# EAGLE board main_V3.0 (EAGLE 7.2.0)
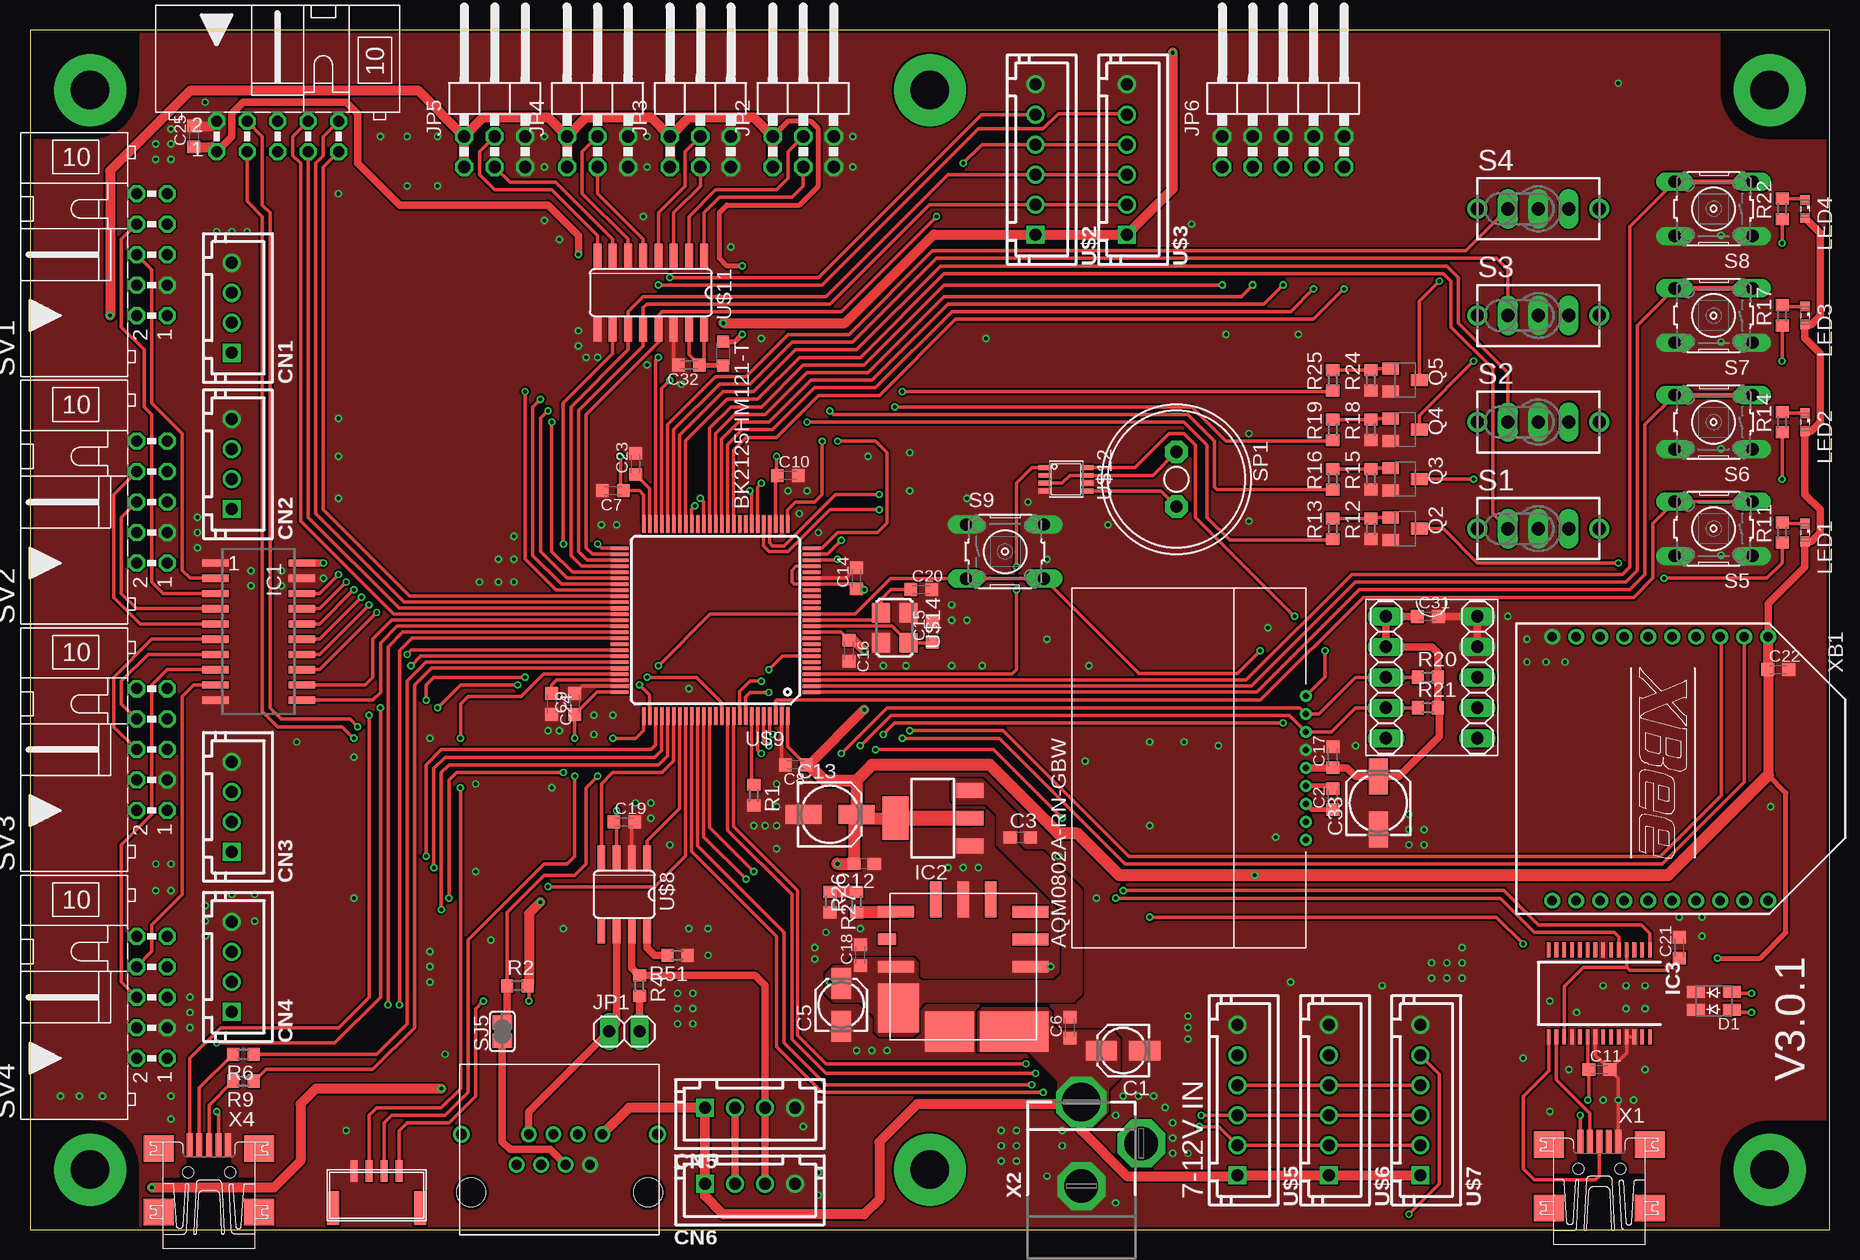
[diagram p3: board, top side]
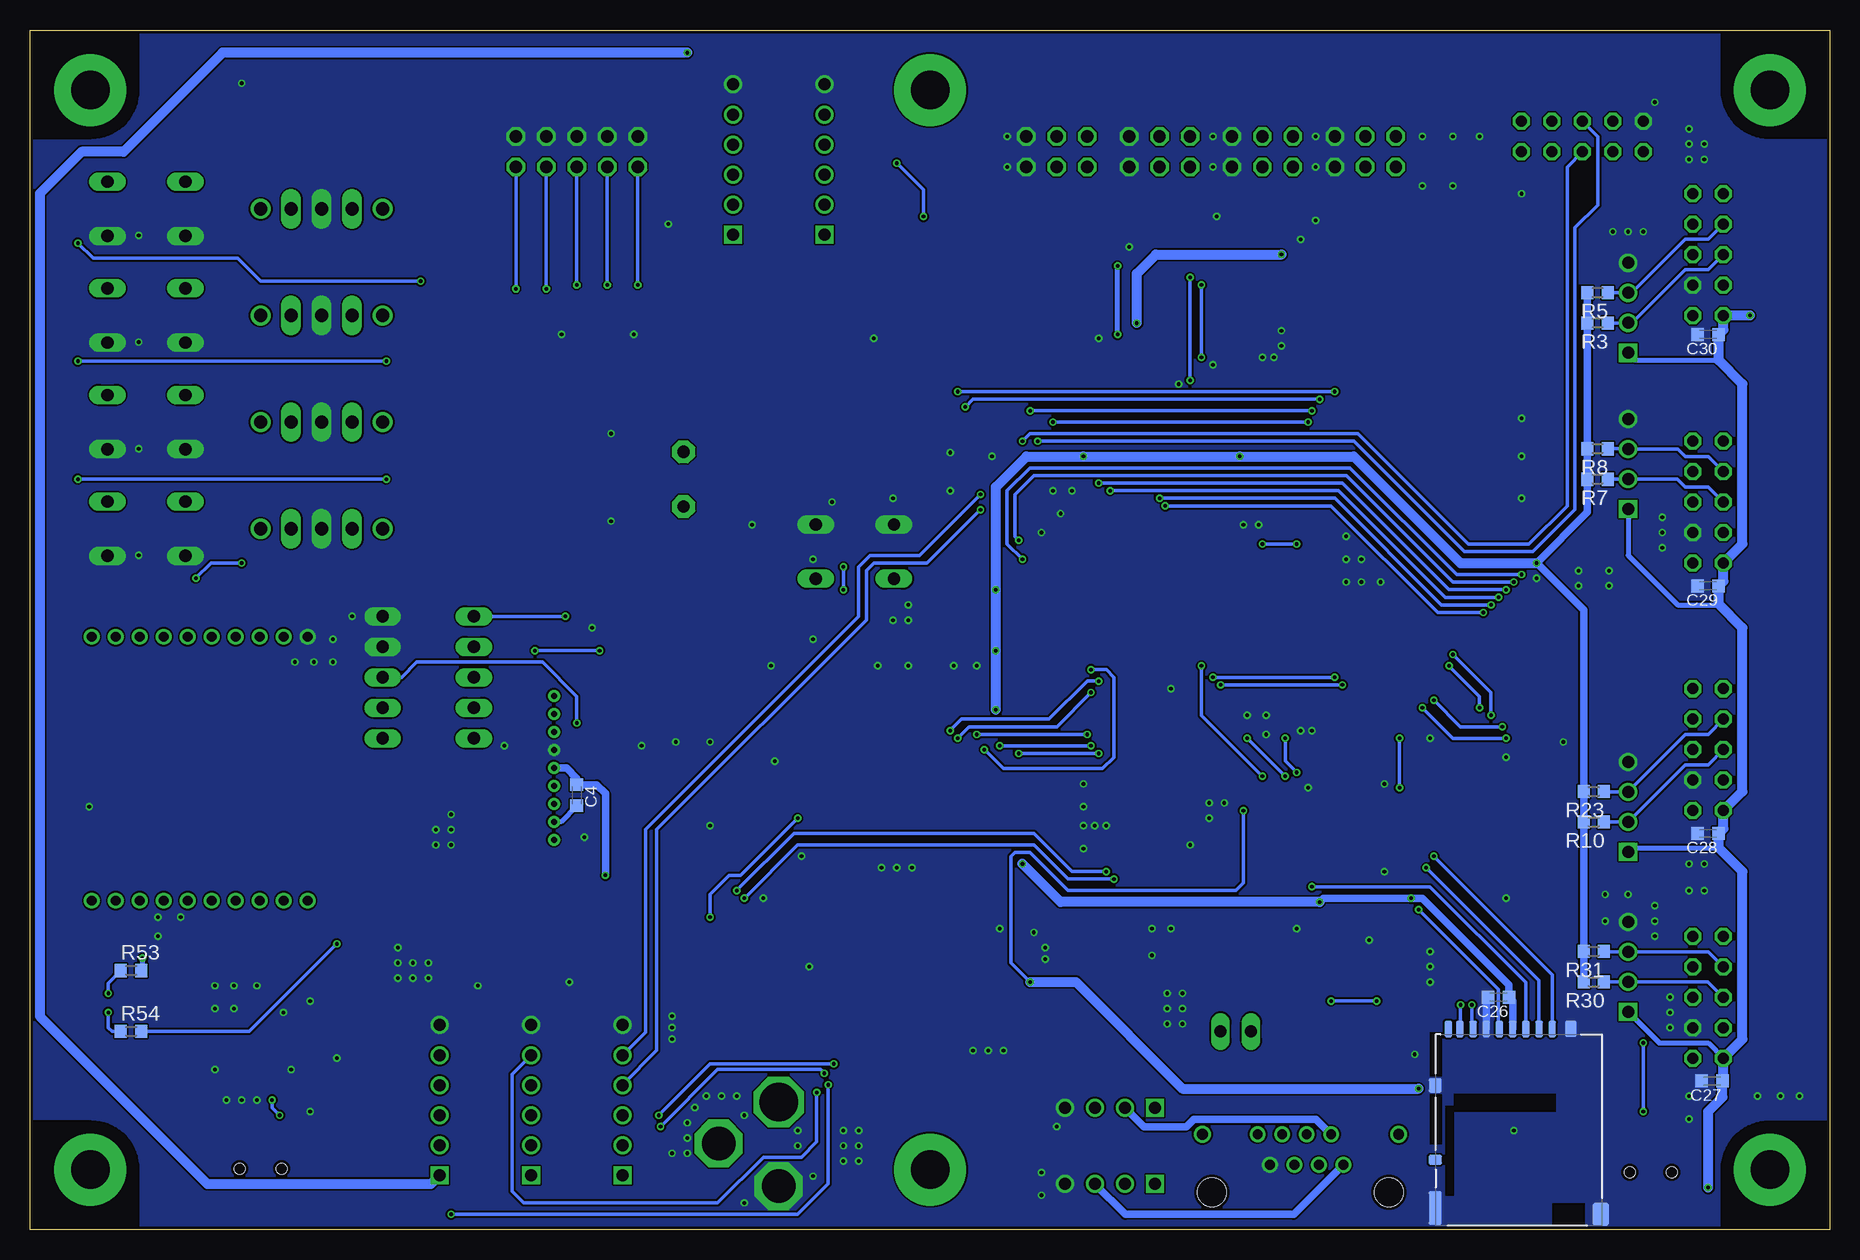
[diagram p4: board, bottom side, seen from below]

Size 150 x 100 mm. Coordinates in mm from the lower left corner, seen from the top.
Outline: 0,0 150,0 150,100 0,100 0,0
Copper layers (1*16): Top 0.035mm / dielectric 1.5mm / Bottom 0.035mm
Design rules "Elecrow_2-layer_eagle_rule": minimum track width 6mil, minimum drill 12mil, track to track 6mil, track to pad 6mil, pad to pad 6mil, via to via 6mil, smd to smd 0mil, copper to edge 10mil, drill to drill 10mil, minimum pad ring 10mil, minimum via ring 6mil, stop-mask expansion 2mil, vias tented up to drill 100mil, thermal gap 10mil
tRestrict: 12 lines
bRestrict: 12 lines

## Footprints (pad centres in the part's own frame; a part is rotated, then mirrored left to right if it is on the bottom)
AQM0802 = drill 0.5: P$1 9,0; P$2 10.5,0; P$3 12,0; P$4 13.5,0; P$5 15,0; P$6 16.5,0; P$7 18,0; P$8 19.5,0; P$9 21,0
L2012C = smd 1 x 1: 1 -1,0; 2 1,0
153CLV-0405 = smd 2.6 x 1.6: + 1.8,0; - -1.8,0
C0603K = smd 1.05 x 1.08: 1 -0.875,0; 2 0.875,0
C0603 = smd 1.1 x 1: 1 -0.85,0; 2 0.85,0
153CLV-0505 = smd 3 x 1.6: + 2.2,0; - -2.2,0
JST-B4B-XH-A = drill 1 square: 1 -3.75,0 | drill 1: 2 -1.25,0; 3 1.25,0; 4 3.75,0
LED3025 = smd 1.5 x 1: 1 1.5,0.75; 2 1.5,-0.75; 3 -1.5,-0.75; 4 -1.5,0.75
SOP20 = smd 0.6 x 2.2: 1 -5.715,-3.6; 2 -4.445,-3.6; 3 -3.175,-3.6; 4 -1.905,-3.6; 5 -0.635,-3.6; 6 0.635,-3.6; 7 1.905,-3.6; 8 3.175,-3.6; 9 4.445,-3.6; 10 5.715,-3.6; 11 5.715,3.6; 12 4.445,3.6; 13 3.175,3.6; 14 1.905,3.6; 15 0.635,3.6; 16 -0.635,3.6; 17 -1.905,3.6; 18 -3.175,3.6; 19 -4.445,3.6; 20 -5.715,3.6
SOT223 = smd 1.219 x 2.235: 1 -2.311,-3.099; 2 0,-3.099; 3 2.311,-3.099 | smd 3.6 x 2.2: TAB 0,3.099
SSOP-28 = smd 0.305 x 1.27: 1 -4.225,-3.625; 2 -3.575,-3.625; 3 -2.925,-3.625; 4 -2.275,-3.625; 5 -1.625,-3.625; 6 -0.975,-3.625; 7 -0.325,-3.625; 8 0.325,-3.625; 9 0.975,-3.625; 10 1.625,-3.625; 11 2.275,-3.625; 12 2.925,-3.625; 13 3.575,-3.625; 14 4.225,-3.625; 15 4.225,3.625; 16 3.575,3.625; 17 2.925,3.625; 18 2.275,3.625; 19 1.625,3.625; 20 0.975,3.625; 21 0.325,3.625; 22 -0.325,3.625; 23 -0.975,3.625; 24 -1.625,3.625; 25 -2.275,3.625; 26 -2.925,3.625; 27 -3.575,3.625; 28 -4.225,3.625
1X02 = drill 1.016 long: 1 -1.27,0; 2 1.27,0
2X03/90 = drill 1.016 octagon: 1 -2.54,-6.35; 2 -2.54,-3.81; 3 0,-6.35; 4 0,-3.81; 5 2.54,-6.35; 6 2.54,-3.81
2X05/90 = drill 1.016 octagon: 1 -5.08,-6.35; 2 -5.08,-3.81; 3 -2.54,-6.35; 4 -2.54,-3.81; 5 0,-6.35; 6 0,-3.81; 7 2.54,-6.35; 8 2.54,-3.81; 9 5.08,-6.35; 10 5.08,-3.81
ML10L = drill 0.914 octagon: 1 -5.08,-1.27; 2 -5.08,1.27; 3 -2.54,-1.27; 4 -2.54,1.27; 5 0,-1.27; 6 0,1.27; 7 2.54,-1.27; 8 2.54,1.27; 9 5.08,-1.27; 10 5.08,1.27
SML0603 = smd 0.8 x 0.8: A 0.75,0; C -0.75,0
SC-59(TYPE1) = smd 1 x 1.4: B -0.95,-1.2; C 0,1.2; E 0.95,-1.2
R0603 = smd 1 x 1.1: 1 -0.85,0; 2 0.85,0
TL3XYO = drill 1.1 pad 1.422 long: 1 -2.54,0; 2 0,0; 3 2.54,0 | drill 1.1 pad 1.676: M1 -5.08,0; M2 5.08,0
B3F-10XX = drill 1.016 long: 1 -3.251,2.261; 2 3.251,2.261; 3 -3.251,-2.261; 4 3.251,-2.261
SJ = smd 1.168 x 1.6: 1 -0.762,0; 2 0.762,0
AL11P = drill 1.016 pad 1.905 octagon: + 2.286,0; - -2.286,0
DM3AT-SF-PEJ = smd 0.65 x 1.4: 1 3.2,16.4; 2 2.1,16.4; 3 1,16.4; 4 -0.1,16.4; 5 -1.2,16.4; 6 -2.3,16.4; 7 -3.4,16.4; 8 -4.5,16.4; CD1 -5.45,16.4 | smd 1.1 x 0.8: CD2 -6.55,5.5 | smd 1.1 x 2.8: GND1 -6.55,1.475 | smd 1.4 x 1.9: GND2 7.25,0.95 | smd 1 x 1.4: GND3 4.75,16.4 | smd 1.1 x 1.2: GND4 -6.55,11.7
JST-B6B-XH-A = drill 1 square: 1 0.08,0 | drill 1: 2 2.58,0; 3 5.08,0; 4 7.58,0; 5 10.08,0; 6 12.62,0
TOP_TYPE_4PIN = smd 0.6 x 1.8: 1 -1.875,2.025; 2 -0.625,2.025; 3 0.625,2.025; 4 1.875,2.025 | smd 1 x 2.8: P$1 -3.625,-1.075; P$2 3.625,-1.075
SO08 = smd 0.66 x 2.032: 1 -1.905,-3.073; 2 -0.635,-3.073; 3 0.635,-3.073; 4 1.905,-3.073; 5 1.905,3.073; 6 0.635,3.073; 7 -0.635,3.073; 8 -1.905,3.073
TQFP100 = smd 1.5 x 0.3: 1 -8,6; 2 -8,5.5; 3 -8,5; 4 -8,4.5; 5 -8,4; 6 -8,3.5; 7 -8,3; 8 -8,2.5; 9 -8,2; 10 -8,1.5; 11 -8,1; 12 -8,0.5; 13 -8,0; 14 -8,-0.5; 15 -8,-1; 16 -8,-1.5; 17 -8,-2; 18 -8,-2.5; 19 -8,-3; 20 -8,-3.5; 21 -8,-4; 22 -8,-4.5; 23 -8,-5; 24 -8,-5.5; 25 -8,-6; 51 8,-6; 52 8,-5.5; 53 8,-5; 54 8,-4.5; 55 8,-4; 56 8,-3.5; 57 8,-3; 58 8,-2.5; 59 8,-2; 60 8,-1.5; 62 8,-0.5; 63 8,0; 64 8,0.5; 65 8,1; 66 8,1.5; 67 8,2; 68 8,2.5; 69 8,3; 70 8,3.5; 72 8,4.5; 73 8,5; 74 8,5.5; 75 8,6 | smd 0.3 x 1.5: 26 -6,-8; 27 -5.5,-8; 28 -5,-8; 29 -4.5,-8; 30 -4,-8; 31 -3.5,-8; 32 -3,-8; 33 -2.5,-8; 34 -2,-8; 35 -1.5,-8; 36 -1,-8; 37 -0.5,-8; 38 0,-8; 39 0.5,-8; 40 1,-8; 41 1.5,-8; 42 2,-8; 43 2.5,-8; 44 3,-8; 45 3.5,-8; 46 4,-8; 47 4.5,-8; 48 5,-8; 49 5.5,-8; 50 6,-8; 76 6,8; 77 5.5,8; 78 5,8; 79 4.5,8; 80 4,8; 81 3.5,8; 82 3,8; 83 2.5,8; 84 2,8; 85 1.5,8; 86 1,8; 87 0.5,8; 88 0,8; 89 -0.5,8; 90 -1,8; 91 -1.5,8; 92 -2,8; 93 -2.5,8; 94 -3,8; 95 -3.5,8; 96 -4,8; 97 -4.5,8; 98 -5,8; 99 -5.5,8; 100 -6,8 | smd 1.5 x 0.35: 61 8,-1; 71 8,4
MPU-9150 = drill 1.016 long: 1 -3.81,5.08; 2 -3.81,2.54; 3 -3.81,0; 4 -3.81,-2.54; 5 -3.81,-5.08; 6 3.81,-5.08; 7 3.81,-2.54; 8 3.81,0; 9 3.81,2.54; 10 3.81,5.08
SO16 = smd 0.66 x 2.032: 1 -4.445,-3.073; 2 -3.175,-3.073; 3 -1.905,-3.073; 4 -0.635,-3.073; 5 0.635,-3.073; 6 1.905,-3.073; 7 3.175,-3.073; 8 4.445,-3.073; 9 4.445,3.073; 10 3.175,3.073; 11 1.905,3.073; 12 0.635,3.073; 13 -0.635,3.073; 14 -1.905,3.073; 15 -3.175,3.073; 16 -4.445,3.073
SSOP08 = smd 0.4 x 1: 1 -0.975,-1.8; 2 -0.325,-1.8; 3 0.325,-1.8; 4 0.975,-1.8; 5 0.975,1.8; 6 0.325,1.8; 7 -0.325,1.8; 8 -0.975,1.8
OKL-T/6-W12 = smd 3 x 0.98: 1 -5.6,0; 9 -5.6,-4.58; 10 -5.6,-2.29 | smd 5.7 x 3.4: 2 -4.25,5.4 | smd 4.07 x 3.4: 3 1.145,5.4 | smd 3.4 x 4.07: 4 5.4,3.435 | smd 3 x 0.96: 5 5.62,0; 6 5.62,-4.58 | smd 0.96 x 3: 7 0,-5.6; 8 -2.29,-5.6; 12 2.29,-5.6 | smd 1.5 x 0.96: 11 6.35,-2.29
ASF = smd 1.6 x 1.5: 1 -1.25,-1.15; 2 1.25,-1.15; 3 1.25,1.15; 4 -1.25,1.15
UX60-MB-5ST = smd 2 x 0.5: 1 2.25,1.6; 2 2.25,0.8; 3 2.25,0; 4 2.25,-0.8; 5 2.25,-1.6 | smd 2.2 x 2.5: M1 -3.3,-4.2; M2 -3.3,4.2; M3 2,4.2; M4 2,-4.2 | hole 0.9: 0,-1.75; 0,1.75
MJ-179P-R = drill 3.2 pad 4 octagon: 1 3,0 | drill 2.8 pad 4 octagon: 2 -4,0; 3 -0.45,-5
LAN = drill 0.8: 1 3.57,1.27; 2 2.55,-1.27; 3 1.53,1.27; 4 0.51,-1.27; 5 -0.51,1.27; 6 -1.53,-1.27; 7 -2.55,1.27; 8 -3.57,-1.27 | drill 0.9: P$11 -8.175,1.27; P$12 8.175,1.27 | hole 2.4: -7.375,-3.57; 7.375,-3.57
XBEE = drill 0.8 pad 1.27: 1 -11,9; 2 -11,7; 3 -11,5; 4 -11,3; 5 -11,1; 6 -11,-1; 7 -11,-3; 8 -11,-5; 9 -11,-7; 10 -11,-9; 11 11,-9; 12 11,-7; 13 11,-5; 14 11,-3; 15 11,-1; 16 11,1; 17 11,3; 18 11,5; 19 11,7; 20 11,9

## Placement (x,y rotation side)
AQM0802A-RN-GBW  [AQM0802]  106.36,23.5 90 top
BK2125HM121-T  [L2012C]  57.78,73.03 270 top
C1  47u  [153CLV-0405]  91.12,14.92 180 top
C2  1u  [C0603K]  108.58,35.88 90 top
C3  [C0603]  82.55,32.7 0 top
C4  1u  [C0603K]  104.46,36.2 270 bottom
C5  47u  [153CLV-0405]  67.63,18.73 90 top
C6  50V,0.1u  [C0603K]  86.68,16.83 90 top
C7  0.1u  [C0603K]  48.58,61.59 180 top
C8  0.1u  [C0603K]  63.82,38.73 180 top
C9  0.1u  [C0603K]  45.4,43.81 90 top
C10  0.1u  [C0603K]  63.18,62.87 0 top
C11  0.1u  [C0603K]  130.81,13.34 0 top
C12  0.1  [C0603]  69.53,30.48 180 top
C13  [153CLV-0505]  66.67,34.61 0 top
C14  0.1u  [C0603K]  68.9,54.29 90 top
C15  22p  [C0603K]  75.25,49.85 90 top
C16  0.1u  [C0603K]  68.26,48.26 270 top
C17  1u  [C0603K]  108.58,39.37 90 top
C18  50V,0.1u  [C0603K]  69.22,22.86 90 top
C19  0.1u  [C0603K]  49.53,33.97 0 top
C20  22p  [C0603K]  74.3,53.34 0 top
C21  0.1u  [C0603K]  137.48,23.5 90 top
C22  0.1u  [C0603K]  145.73,46.67 0 top
C23  0.1u  [C0603K]  50.48,63.82 90 top
C24  0.1u  [C0603K]  43.5,43.81 270 top
C25  0.1u  [C0603K]  13.65,91.12 90 top
C26  0.1u  [C0603K]  27.62,19.37 180 bottom
C27  0.1u  [C0603K]  9.84,12.38 180 bottom
C28  0.1u  [C0603K]  10.16,33.02 180 bottom
C29  0.1u  [C0603K]  10.16,53.66 180 bottom
C30  0.1u  [C0603K]  10.16,74.61 180 bottom
C31  0.1u  [C0603K]  116.52,51.12 0 top
C32  0.1u  [C0603K]  54.93,72.07 180 top
C33  [153CLV-0505]  112.39,35.56 90 top
CN1  CN4-JST-XH-TOP  [JST-B4B-XH-A]  16.83,76.83 90 top
CN2  CN4-JST-XH-TOP  [JST-B4B-XH-A]  16.83,63.82 90 top
CN3  CN4-JST-XH-TOP  [JST-B4B-XH-A]  16.83,35.24 90 top
CN4  CN4-JST-XH-TOP  [JST-B4B-XH-A]  16.83,21.91 90 top
CN5  CN4-JST-XH-TOP  [JST-B4B-XH-A]  60.01,10.16 0 top
CN6  CN4-JST-XH-TOP  [JST-B4B-XH-A]  60.01,3.81 0 top
D1  SEC2XX4  [LED3025]  140.34,19.05 180 top
IC1  74541  [SOP20]  19.05,49.85 270 top
IC2  LM1117IMPX-3.3  [SOT223]  75.25,34.29 90 top
IC3  FT232RL  [SSOP-28]  130.81,19.68 180 top
JP1  [1X02]  49.53,16.51 0 top
JP2  [2X03/90]  64.45,94.93 0 top
JP3  [2X03/90]  55.88,94.93 0 top
JP4  [2X03/90]  47.31,94.93 0 top
JP5  [2X03/90]  38.73,94.93 0 top
JP6  [2X05/90]  104.46,94.93 0 top
JP7  MOTOR  [ML10L]  20.64,91.12 0 top
LED1  [SML0603]  147.96,58.1 270 top
LED2  [SML0603]  147.96,67.31 270 top
LED3  [SML0603]  147.96,76.2 270 top
LED4  [SML0603]  147.96,85.09 270 top
Q2  2SC2712  [SC-59(TYPE1)]  114.62,58.42 270 top
Q3  2SC2712  [SC-59(TYPE1)]  114.62,62.55 270 top
Q4  2SC2712  [SC-59(TYPE1)]  114.62,66.67 270 top
Q5  2SC2712  [SC-59(TYPE1)]  114.62,70.8 270 top
R1  10k  [R0603]  60.33,36.2 270 top
R2  10k  [R0603]  40.64,20.32 0 top
R3  2.2k  [R0603]  19.37,75.56 180 bottom
R4  120  [R0603]  50.8,20.32 270 top
R5  2.2k  [R0603]  19.37,78.11 180 bottom
R6  22  [R0603]  17.78,14.61 180 top
R7  2.2k  [R0603]  19.37,62.55 180 bottom
R8  2.2k  [R0603]  19.37,65.09 180 bottom
R9  22  [R0603]  17.78,12.38 180 top
R10  2.2k  [R0603]  19.68,33.97 180 bottom
R11  1k  [R0603]  146.05,58.1 90 top
R12  10k  [R0603]  111.76,58.42 90 top
R13  10k  [R0603]  108.58,58.42 90 top
R14  1k  [R0603]  146.05,67.31 90 top
R15  10k  [R0603]  111.76,62.55 90 top
R16  10k  [R0603]  108.58,62.55 90 top
R17  1k  [R0603]  146.05,76.2 90 top
R18  10k  [R0603]  111.76,66.67 90 top
R19  10k  [R0603]  108.58,66.67 90 top
R20  4,7k  [R0603]  116.52,46.04 0 top
R21  4,7k  [R0603]  116.52,43.5 0 top
R22  1k  [R0603]  146.05,85.09 90 top
R23  2.2k  [R0603]  19.68,36.51 180 bottom
R24  10k  [R0603]  111.76,70.8 90 top
R25  10k  [R0603]  108.58,70.8 90 top
R26  1k  [R0603]  68.9,27.3 90 top
R27  330  [R0603]  66.67,27.3 270 top
R30  2.2k  [R0603]  19.68,20.64 180 bottom
R31  2.2k  [R0603]  19.68,23.18 180 bottom
R51  33k  [R0603]  53.98,22.86 180 top
R53  1K  [R0603]  141.6,21.59 0 bottom
R54  470  [R0603]  141.6,16.51 0 bottom
S1  TL32YO  [TL3XYO]  125.73,58.42 0 top
S2  TL32YO  [TL3XYO]  125.73,67.31 0 top
S3  TL32YO  [TL3XYO]  125.73,76.2 0 top
S4  TL32YO  [TL3XYO]  125.73,85.09 0 top
S5  [B3F-10XX]  140.34,58.42 180 top
S6  [B3F-10XX]  140.34,67.31 180 top
S7  [B3F-10XX]  140.34,76.2 180 top
S8  [B3F-10XX]  140.34,85.09 180 top
S9  [B3F-10XX]  81.28,56.52 0 top
SJ5  [SJ]  39.37,16.51 90 top
SP1  PKM13EPYH4000  [AL11P]  95.57,62.55 270 top
SV1  [ML10L]  10.16,81.28 90 top
SV2  [ML10L]  10.16,60.64 90 top
SV3  [ML10L]  10.16,40.01 90 top
SV4  [ML10L]  10.16,19.37 90 top
U$1  MICRO-SD-CARD  [DM3AT-SF-PEJ]  26.35,0.32 0 bottom
U$2  CN6  [JST-B6B-XH-A]  83.82,82.87 90 top
U$3  CN6  [JST-B6B-XH-A]  91.44,82.87 90 top
U$4  TOP_TYPE_4PIN  [TOP_TYPE_4PIN]  28.89,2.86 0 top
U$5  CN6  [JST-B6B-XH-A]  100.65,4.45 90 top
U$6  CN6  [JST-B6B-XH-A]  108.27,4.45 90 top
U$7  CN6  [JST-B6B-XH-A]  115.89,4.45 90 top
U$8  MCP2551SO8  [SO08]  49.53,27.94 180 top
U$9  STM32F407V  [TQFP100]  57.15,50.8 180 top
U$10  MPU-9150  [MPU-9150]  116.84,46.04 0 top
U$11  MCP3208  [SO16]  51.75,78.11 180 top
U$12  TC7WH04FK  [SSOP08]  86.36,62.55 270 top
U$13  OKL-T/6-W12N  [OKL-T/6-W12]  77.79,21.91 180 top
U$14  FA238-25MHz  [ASF]  72.07,50.16 270 top
X1  MINI-USB-UX60-MB-5ST  [UX60-MB-5ST]  130.81,5.08 90 top
X2  DCJACK-MJ179P-R  [MJ-179P-R]  87.63,7.62 90 top
X3  RJ45  [LAN]  44.13,6.67 0 top
X4  MINI-USB-UX60-MB-5ST  [UX60-MB-5ST]  14.92,4.76 90 top
XB1  XBEE  [XBEE]  135.89,38.42 270 top

## Tracks (layer width: path | path; a pad name or v marks a point on that pad's centre or on a via)
+3V3  (via drill 0.3)
  Top 0.305: C16.1 67.6,49.8 U$9.11 | U$9.75 47.26,44.8 C9.1 v45.4,40.96 | U$9.50 51.15,61.24 50.8,61.59 C7.1 49.21,61.84 v49.21,64.45 | U$9.28 62.15,62.71 C10.1 62.23,62.94 v62.23,64.45 | U$9.100 63.15,40.28 C8.1 | v44.45,38.1 35.56,38.1 34.92,37.47 v34.92,27.62 | v69.53,53.34 68.97,53.34 C14.1 68.52,53.8 U$9.19 63.67,53.8 63.5,53.98 63.5,54.93 63.87,55.3 U$9.22 | U$4.4 30.77,8.22 31.43,8.89 34.92,8.89 37.15,11.11 37.15,18.41 v37.78,19.05 | v41.59,19.05 41.59,20.22 R2.2 | U$12.8 92.1,63.52 94.93,66.36 96.2,66.36 97.16,65.41 97.16,59.37 v105.41,51.12
  Top 0.406: v140.65,22.62 144.22,22.62 146.37,24.77 146.37,36.41 144.89,37.89
  Top 0.61: v24.45,55.56 IC1.20 | C31.1 U$10.1 U$10.2 116.84,48.58 117.37,48.05 R20.2 R21.2 117.47,43.4 117.47,41.12 114.12,37.76 C33.+ 110.51,37.76 109.78,38.49 C17.1 | 108.67,38.58 C17.1 | C17.1 AQM0802A-RN-GBW.P$5 | LED4.A 149.22,83.07 149.22,76.2 148.47,75.45 LED3.A 147.96,74.3 149.22,73.03 149.22,67.31 148.47,66.56 LED2.A 147.96,61.28 149.22,60.01 149.22,58.1 148.47,57.35 LED1.A 147.96,55.24 144.89,52.18 XB1.1
  Top 0.813: v69.53,48.26 68.66,49.13 C16.1 | v42.55,27.3 41.59,26.35 41.59,20.42 R2.2 | C8.1 64.93,38.73 v69.53,43.34 | 144.89,37.89 144.89,46.64 C22.1 144.89,46.7 XB1.1
  Top 1.016: 144.89,37.89 136.53,29.53 v102.08,29.53 90.81,29.53 87.31,33.02 85.72,33.02 80.01,38.73 70.17,38.73 68.88,37.44 | v67.31,30.48 C12.2 68.68,34.41 C13.+ | C13.+ 69.19,34.29 IC2.TAB | 68.88,37.44 C13.+ | 64.93,38.73 66.22,37.44 68.88,37.44
  Top 1.27: IC2.2 IC2.TAB
  Bottom 0.305: v45.4,40.96 45.4,39.05 v44.45,38.1 | v37.78,19.05 v41.59,19.05 | v105.41,51.12 U$10.1
  Bottom 0.406: R53.2 140.65,21.69 v140.65,22.62
  Bottom 0.61: U$1.4 26.45,19.07 C26.1 26.75,20.4 33.97,27.62 v34.92,27.62 42.23,27.62 v42.55,27.3 | R5.2 R3.2 R8.2 R7.2 20.22,59.79 v24.45,55.56 20.54,51.65 R23.2 R10.2 R31.2 R30.2 | AQM0802A-RN-GBW.P$5 105.33,38.49 104.46,37.62 C4.1 102.79,37.07 102.08,36.35 v102.08,29.53
  Bottom 0.813: v69.53,43.34 v69.53,48.26 v69.53,53.34 69.53,61.91 66.99,64.45 v62.23,64.45 v49.21,64.45 39.69,64.45 30.8,55.56 v24.45,55.56 | v42.55,27.3 64.14,27.3 v67.31,30.48
+5V  (via drill 0.3)
  Top 0.305: v48.9,34.92 48.9,34.21 C19.1 48.9,33.73 U$8.3
  Top 0.406: BK2125HM121-T.1 58.78,74.03 v59.37,74.61 | v59.37,80.33 58.1,80.33 57.47,80.96 57.47,84.77 58.1,85.41 64.14,85.41 65.72,87 65.72,91.76 65.09,92.39 63.18,92.39 JP2.2
  Top 0.813: v10.16,3.49 20.32,3.49 22.54,5.71 22.54,10.48 23.81,11.75 v34.29,11.75 | JP5.1 JP5.2 | JP5.2 32.38,94.93 13.34,94.93 6.67,88.27 v6.67,76.2 | JP5.2 37.78,92.71 43.18,92.71 JP4.2 | 44.77,91.44 JP4.2 | JP4.2 46.35,92.71 51.75,92.71 JP3.2 | JP3.2 54.93,92.71 60.33,92.71 JP2.2 JP2.1 | JP3.2 JP3.1 | JP4.2 JP4.1
  Bottom 0.305: v48.9,34.92 48.9,28.89 49.53,28.26 63.5,28.26 66.67,31.43 67.94,31.43 68.26,31.11 68.26,22.23 v66.67,20.64
  Bottom 0.406: CN3.1 16.49,31.83 9.29,31.83 | CN4.1 14.23,15.56 10.16,15.56 SV4.2 | CN2.1 16.83,56.2 12.7,52.07 9.36,52.07 9.29,52.15 | CN1.1 16.21,72.47 9.29,72.47 | v59.37,74.61 v59.37,80.33
  Bottom 0.813: v34.29,11.75 53.98,11.75 62.87,20.64 v66.67,20.64 | v10.16,3.49 10.16,9.84 8.97,11.04 C27.1 8.89,12.46 SV4.2 7.3,15.88 7.3,29.84 9.29,31.83 C28.1 8.89,33.41 SV3.2 7.3,36.51 7.3,50.16 9.29,52.15 C29.1 8.89,54.05 SV2.2 7.3,57.15 7.3,70.48 9.29,72.47 C30.1 8.89,75.01 SV1.2 v6.67,76.2
  pour Top (no thermals): 73.98,16.51 73.98,18.41 74.61,19.05 87,19.05 87.63,19.68 87.63,28.26 84.45,31.43 82.87,31.43 82.23,32.07 82.23,34.61 79.38,37.47 77.15,37.47 76.83,37.15 76.83,35.88 77.15,35.56 79.69,35.56 80.64,34.61 80.64,32.07 86.04,26.67 86.04,21.27 85.41,20.64 74.3,20.64 73.98,20.95 73.98,22.23 73.66,22.54 68.58,22.54 67.94,21.91 66.99,21.91 66.36,21.27 66.36,19.68 66.99,19.05 69.22,19.05 70.48,17.78 70.48,16.51 70.8,16.19 73.66,16.19
+7V  (via drill 0.3)
  Top 0.61: JP7.1 16.83,91.12 16.83,93.03 17.78,93.98 26.35,93.98 27.3,93.03 27.3,88.9 30.8,85.41 43.18,85.41 45.72,82.87 v45.72,81.28
  Top 0.813: C25.1 15.16,90.25 JP7.1 | U$7.1 U$6.1 U$5.1 100.57,4.45 91.44,4.45 87.63,8.26 X2.1 87.49,10.48 73.98,10.48 70.8,7.3 70.8,2.54 69.53,1.27 57.78,1.27 56.26,2.8 CN6.1 CN5.1 49.92,10.16 X3.1 | v57.78,75.56 67.94,75.56 75.33,82.95 U$2.1 U$3.1 95.25,86.76 v95.25,98.11
  Bottom 0.813: v57.78,75.56 57.78,79.69 56.2,81.28 v45.72,81.28 | v95.25,98.11 133.99,98.11 142.24,89.85 145.73,89.85 149.22,86.36 149.22,17.78 135.25,3.81 116.6,3.81 U$7.1
  pour Top (no thermals): 85.72,9.84 87,8.57 88.58,8.57 89.85,9.84 89.85,11.75 90.81,12.7 90.81,15.88 90.17,16.51 86.04,16.51 85.72,16.51 85.09,17.14 85.09,18.1 84.77,18.41 79.38,18.41 79.06,18.1 79.06,14.92 83.19,14.92 85.72,12.38
CANH
  Top 0.61: U$8.7 50.16,21.8 R4.1 60.43,21.17 61.26,20.34 CN5.3 CN6.3
  Bottom 0.61: X3.8 44.69,1.27 58.74,1.27 61.26,3.79 CN6.3
CANL
  Top 0.61: X3.7 41.58,9.83 JP1.1 48.9,17.14 U$8.6 | CN5.2 CN6.2
  Bottom 0.61: CN5.2 57.17,8.57 53.66,8.57 53.02,9.21 42.85,9.21 X3.7
CH0
  Top 0.305: U$11.1 56.2,84.77 57.47,86.04 63.5,86.04 64.45,87 JP2.3
CH1
  Top 0.305: U$11.2 54.93,84.45 57.15,86.68 62.23,86.68 63.18,87.63 63.18,89.85 JP2.4
CH2
  Top 0.305: U$11.3 53.66,84.77 55.88,87 JP3.3
CH3
  Top 0.305: U$11.4 52.39,84.77 54.61,87 54.61,89.85 JP3.4
CH4
  Top 0.305: U$11.5 51.12,82.55 47.31,86.36 JP4.3
CH5
  Top 0.305: U$11.6 49.85,82.55 46.04,86.36 46.04,89.85 JP4.4
CH6
  Top 0.305: U$11.7 48.58,82.55 43.81,87.31 40.01,87.31 JP5.3
CH7
  Top 0.305: U$11.8 47.31,82.87 43.5,86.68 38.73,86.68 37.47,87.95 37.47,89.85 JP5.4
ENC1A
  Top 0.305: SV1.6 10.16,80.01 10.16,68.9 12.7,66.36 12.7,54.93 13.34,54.29 IC1.2
  Bottom 0.305: R3.1 16.85,75.56 CN1.2 16.49,75.58 12.06,80.01 10.16,80.01 SV1.6
ENC1B
  Top 0.305: SV1.8 7.62,82.55 7.62,75.25 9.53,73.34 9.53,68.58 10.16,67.94 10.16,53.98 11.11,53.02 IC1.3
  Bottom 0.305: R5.1 16.85,78.11 CN1.3 16.53,78.08 12.06,82.55 10.16,82.55 SV1.8
ENC2A
  Top 0.305: SV2.6 7.62,59.37 7.62,53.02 8.89,51.75 IC1.4
  Bottom 0.305: SV2.6 10.16,61.91 12.06,61.91 12.72,62.57 CN2.2 16.85,62.55 R7.1
ENC2B
  Top 0.305: SV2.8 6.99,61.28 6.99,52.7 9.21,50.48 IC1.5
  Bottom 0.305: SV2.8 10.16,64.45 12.06,64.45 12.68,65.07 CN2.3 16.85,65.09 R8.1
ENC3A
  Top 0.305: SV3.6 6.99,41.91 6.99,46.04 10.16,49.21 IC1.6
  Bottom 0.305: SV3.6 10.16,38.73 12.06,38.73 16.81,33.99 CN3.2 18.82,33.99 R10.1
ENC3B
  Top 0.305: SV3.8 7.62,43.81 7.62,45.72 9.84,47.94 IC1.7
  Bottom 0.305: SV3.8 10.16,41.27 12.06,41.27 16.83,36.51 CN3.3 18.82,36.49 R23.1
ENC4A
  Top 0.305: SV4.6 7.62,20.64 7.62,32.07 10.16,34.61 10.16,45.4 11.43,46.67 IC1.8
  Bottom 0.305: SV4.6 10.18,20.66 CN4.2 18.82,20.66 R30.1
ENC4B
  Top 0.305: SV4.8 10.16,23.18 10.16,25.4 12.7,27.94 12.7,44.45 13.65,45.4 IC1.9
  Bottom 0.305: SV4.8 10.14,23.16 CN4.3 18.82,23.16 R31.1
GND  (via drill 0.3)
  Top 0.305: C19.2 50.16,33.73 U$8.2 | C9.2 46.01,45.3 U$9.74 | C32.2 53.66,72.47 U$11.14 | C11.2 130.49,14.54 IC3.21 | C11.2 133.09,14.73 IC3.25 IC3.26 | X1.5 132.41,12.61 C11.2 | U$9.99 62.65,39.03 C8.2 | U$9.20 68.03,54.3 C14.2
  Top 0.61: C31.2 U$10.10 U$10.9
  Top 0.813: C25.2 15.16,92 JP7.2
  Bottom 0.61: C26.2 28.65,19.21 U$1.6
  other vias: 51.75,34.29 50.48,35.56 51.75,35.56 44.13,41.59 43.18,41.59 95.25,7.62 95.25,8.89 95.25,6.35 96.52,6.35 90.49,2.22 94.61,10.16 92.39,11.11 93.66,11.11 91.12,11.11 132.4,10.79 133.67,10.79 131.13,10.79 42.86,88.58 42.86,91.12 51.44,91.12 51.44,88.58 68.58,88.58 68.58,91.12 47.31,72.71 46.35,72.71 45.72,73.66 45.72,74.93 20.95,54.93 20.95,53.66 24.45,54.29 18.41,53.66 18.41,54.93 116.2,32.07 114.94,32.07 114.94,33.34 116.2,33.34 96.52,16.83 96.52,15.88 96.52,17.78 76.83,52.07 76.83,50.8 78.11,50.8 46.99,41.27 48.58,42.86 46.99,42.86 43.5,36.83 37.15,29.84 37.15,37.15 33.34,40.96 26.99,39.37 139.38,24.45 137.48,26.04 139.38,26.04 63.18,61.59 64.77,61.59 37.47,53.98 39.05,53.98 39.05,55.88 40.32,55.88 40.32,53.98 40.32,57.78 48.9,58.74 47.62,58.74 25.72,60.96 25.72,64.45 25.72,67.63 13.97,58.1 13.97,59.37 13.97,56.83 16.83,83.19 18.1,83.19 15.56,83.19 11.75,9.21 11.75,11.11 13.34,16.83 13.34,18.1 13.34,19.37 14.61,25.72 14.61,24.45 14.61,26.99 18.73,25.72 16.83,27.94 18.73,27.94 56.52,22.86 54.93,25.08 56.52,25.08 84.77,4.45 90.49,9.53 86.04,8.26 86.04,6.99 82.23,8.26 82.23,6.99 82.23,5.71 80.96,5.71 80.96,6.99 80.96,8.26 62.23,35.24 60.33,33.66 61.28,33.66 62.23,33.66 62.23,37.15 65.72,58.1 64.14,59.69 69.85,64.45 73.34,64.77 73.34,61.59 33.97,87 33.97,91.12 31.43,87 31.43,91.12 29.21,91.12 14.61,93.98 11.75,91.76 11.75,90.49 11.75,89.22 10.48,89.22 10.48,90.49 10.48,28.26 10.48,30.48 11.75,30.48 11.75,28.26 84.77,49.21 84.77,55.88 103.19,50.16 93.34,40.64 96.2,40.64 99.06,40.32 127.95,47.31 126.36,47.31 124.78,47.31 124.78,49.21 119.38,23.5 119.38,22.23 119.38,20.95 118.11,20.95 118.11,22.23 116.84,22.23 116.84,20.95 65.41,22.54 65.41,23.5 66.36,24.77 55.24,19.68 55.24,18.41 55.24,17.14 53.98,19.68 53.98,18.41 53.98,17.14 26.35,8.26 34.61,14.61 2.54,11.11 4.13,11.11 6.03,11.11 134.62,20.32 134.62,18.41 133.03,18.41 133.03,20.32 112.71,20.32 105.09,20.64 126.68,9.84 26.99,27.62 58.42,81.92 51.12,84.45 44.13,82.55 42.86,84.14 96.84,83.82 78.11,60.96 101.6,66.36 89.85,58.74 101.6,59.05 114.94,34.61 103.82,32.7 93.34,33.66 87.95,39.05 62.23,31.75 44.45,25.08 33.34,21.91 33.34,20.64 33.34,23.18 22.23,40.64 88.27,46.99 79.38,46.99 76.83,46.99 123.19,51.12 145.1,35.24 134.62,13.34 71.12,46.99 73.03,46.99 54.93,45.09 53.34,32.07 25.72,86.36 124.46,14.29 85.72,31.11 88.9,27.62 68.9,14.92 70.17,14.92 71.44,14.92 54.29,70.48 60.96,74.3 79.69,74.3 140.97,56.2 131.13,20.32 105.73,74.61 99.69,74.61 38.42,24.13 64.45,8.57 65.72,4.76 65.72,2.86 51.44,72.07 132.4,95.57 83.19,60.64 140.97,65.09 140.97,73.98 140.97,82.87 128.27,13.34 128.91,18.1 126.68,19.05 110.49,40.32 85.09,21.91 77.79,30.16 79.06,30.16 76.52,30.16 69.22,25.08
  pour Bottom (rank 5, no thermals): -9.84,109.22 157.8,109.22 157.8,-6.03 -9.84,-6.03
  pour Top (rank 5, no thermals): -8.89,108.27 156.21,108.27 156.21,-2.86 -8.89,-2.86
N$1  (via drill 3.2 pad 6)
  other vias: 145,95
N$2
  Top 0.305: X1.2 130.01,9.69 127.23,12.46 IC3.16
N$3
  Top 0.305: X1.3 130.81,4.45 130.49,4.13 125.41,4.13 124.46,5.08 124.46,11.11 126.58,13.24 IC3.15
N$4
  Top 0.305: R6.2 14.12,11.8 X4.2
N$5
  Top 0.305: R9.2 14.92,10.38 X4.3
N$8
  Top 0.406: C2.2 108.34,36.99 AQM0802A-RN-GBW.P$4
N$9
  Top 0.61: U$8.8 51.44,23.5 52.07,22.86 R51.2
N$10
  Bottom 0.406: C4.2 105.78,33.99 AQM0802A-RN-GBW.P$2
N$11
  Top 0.61: X3.4 43.37,6.67 40.01,6.67 39.37,7.3 SJ5.1
N$12  (via drill 0.3)
  Top 0.305: Q2.C 117.79,58.42 120.65,55.56 v132.4,55.56 | v136.21,54.29 144.78,54.29 146.05,55.56 R11.1
  Bottom 0.305: v132.4,55.56 134.94,55.56 v136.21,54.29
N$13  (via drill 0.3)
  Top 0.305: v143.51,19.68 141.84,19.68 D1.3
  Bottom 0.305: R53.1 143.51,20.54 v143.51,19.68
N$14  (via drill 0.3)
  Top 0.305: X1.1 129.22,7.34 v129.22,9.53 | v129.86,10.79 129.94,10.87 C11.1 129.84,13.44 IC3.20
  Bottom 0.305: v129.22,9.53 129.86,10.16 v129.86,10.79
N$15
  Top 0.305: LED1.C 146.78,58.85 R11.2
N$16
  Top 0.406: AQM0802A-RN-GBW.P$3 106.86,35 C2.1
N$17  (via drill 0.3)
  Top 0.305: U$9.72 42.81,46.3 40.96,44.45 36.51,44.45 35.88,43.81 v35.88,40.96 | v35.88,36.83 35.88,11.75 34.29,10.16 28.89,10.16 28.26,9.53 28.26,4.89 U$4.2
  Bottom 0.305: v35.88,40.96 v35.88,36.83
N$18  (via drill 0.3)
  Top 0.305: U$9.76 51.15,41.62 50.48,40.96 v48.58,40.96 | v45.4,37.78 45.4,31.11 44.77,30.48 42.86,30.48 36.51,24.13 36.51,11.43 34.61,9.53 30.16,9.53 29.53,8.89 29.53,4.89 U$4.3
  Bottom 0.305: v48.58,40.96 v45.4,37.78
N$19
  Top 0.305: U$9.12 71.84,50.3 U$14.3 75.19,48.91 C15.1
N$20
  Top 0.305: U$9.13 70.31,50.8 U$14.1 70.92,52.51 71.75,53.34 C20.1
N$21
  Top 0.305: SP1.- 93.61,62.87 U$12.7 86.69,62.87 86.03,62.22 U$12.3
N$22
  Top 0.305: U$9.94 60.15,37.22 R1.1
N$23
  Top 0.305: U$9.73 43.9,45.8 43.5,45.4 C24.1
N$24  (via drill 0.3)
  Top 0.305: v143.51,18.1 142.04,18.1 D1.4
  Bottom 0.305: R54.1 143.19,16.51 143.51,16.83 v143.51,18.1
N$25
  Top 0.61: JP1.2 R4.2
N$26
  Top 0.305: U$11.16 56.2,72.47 C32.1 54.93,72.95 U$11.15
  Top 0.406: BK2125HM121-T.2 55.8,72.03 C32.1
N$27
  Top 0.305: U$9.49 51.65,61.77 C23.1
N$28
  Top 0.305: SP1.+ 94.26,61.57 U$12.5
N$29  (via drill 0.3)
  Top 0.305: Q3.C v120.33,62.55 | v146.05,62.55 R14.1
  Bottom 0.305: v120.33,62.55 v146.05,62.55
N$30
  Top 0.305: Q3.B 111.86,63.5 R15.2 R16.2
N$31
  Top 0.305: LED2.C 146.15,68.06 R14.2
N$32  (via drill 0.3)
  Top 0.305: Q4.C 115.82,67.88 v120.33,72.39 | v146.05,72.39 R17.1
  Bottom 0.305: v120.33,72.39 v146.05,72.39
N$33
  Top 0.305: Q4.B 111.86,67.62 R18.2 R19.2
N$34
  Top 0.305: LED3.C 146.15,76.95 R17.2
N$35  (via drill 0.3)
  Top 0.305: Q5.C 115.82,77.4 v117.47,79.06 | v146.05,82.23 R22.1
  Bottom 0.305: v117.47,79.06 130.81,79.06 132.72,80.96 144.78,80.96 v146.05,82.23
N$36
  Top 0.305: Q5.B 111.86,71.75 R24.2 R25.2
N$37
  Top 0.305: R22.2 147.85,85.94 LED4.C
N$38
  Top 0.305: 133.09,21.86 133.35,21.59 136.45,21.59 C21.1 | 133.09,21.86 IC3.4 | IC3.17 127.89,20.25 129.49,21.86 133.09,21.86
N$39
  Top 1.016: U$13.6 72.14,26.45 R26.1
N$40
  Top 1.016: R26.2 R27.1
N$115
  Top 0.305: Q2.B 111.86,59.37 R12.2 R13.2
N$902  (via drill 3.2 pad 6)
  other vias: 75,95
N$903  (via drill 3.2 pad 6)
  other vias: 5,95
PA0_TIM5_CH1  (via drill 0.3)
  Top 0.305: IC1.18 24.13,53.02 v25.72,54.61 | v67.31,55.88 67.23,55.8 U$9.23
  Bottom 0.305: v25.72,54.61 31.11,54.61 40.01,63.5 66.67,63.5 68.58,61.59 68.58,57.15 v67.31,55.88
PA1_TIM5_CH2  (via drill 0.3)
  Top 0.305: IC1.17 24.13,51.75 v26.35,53.98 | v67.63,57.47 66.46,56.3 U$9.24
  Bottom 0.305: v26.35,53.98 31.43,53.98 40.32,62.87 66.36,62.87 67.94,61.28 67.94,57.78 v67.63,57.47
PA2_TIM2_CH3  (via drill 0.3)
  Top 0.305: U$9.25 66.01,56.8 67.31,58.1 70.64,58.1 71.44,58.9 71.44,64.77 70.48,65.72 v67.31,65.72
  Bottom 0.305: v67.31,65.72 66.67,66.36 39.37,66.36 30.16,57.15 25.08,57.15 21.91,60.33 21.91,88.58 JP7.5
PA3_TIM2_CH4  (via drill 0.3)
  Top 0.305: U$9.26 63.15,59.98 63.82,60.64 65.41,60.64 66.04,61.28 v66.04,65.72
  Bottom 0.305: v66.04,65.72 39.69,65.72 30.48,56.52 24.77,56.52 21.27,60.01 21.27,83.5 19.37,85.41 19.37,91.12 JP7.6
PA4_SPI1_SS0  (via drill 0.3)
  Top 0.305: U$9.29 61.65,57.25 61.91,56.99 62.87,56.99 67.15,61.28 v70.8,61.28
  Bottom 0.305: U$5.5 98.74,16.43 98.74,33.02 98.74,33.34 80.96,51.12 80.96,55.24 80.01,56.2 75.88,56.2 v70.8,61.28
PA5_SPI1_SCK  (via drill 0.3)
  Top 0.305: U$9.30 61.15,56.96 61.59,56.52 63.18,56.52 66.67,60.01 v70.8,60.01 | U$5.4 U$6.4 U$7.4
  Bottom 0.305: U$5.4 100.65,12.06 97.79,14.92 97.79,33.34 80.33,50.8 80.33,54.93 79.69,55.56 75.25,55.56 v70.8,60.01
PA6_TIM3_CH1  (via drill 0.3)
  Top 0.305: IC1.16 24.13,50.48 v26.99,53.34 | U$9.31 60.65,61.91 v60.96,62.23
  Bottom 0.305: v26.99,53.34 31.75,53.34 40.64,62.23 v60.96,62.23
PA7_TIM3_CH2  (via drill 0.3)
  Top 0.305: IC1.15 24.13,49.21 v27.62,52.7 | v60.01,61.59 60.15,61.45 U$9.32
  Bottom 0.305: v27.62,52.7 32.07,52.7 40.96,61.59 v60.01,61.59
PA9_USB_VBUS  (via drill 0.3)
  Top 0.305: X4.1 13.32,14.28 15.88,16.83 25.72,16.83 28.26,19.37 v28.26,42.86 | v31.43,47.94 31.79,48.3 U$9.68
  Bottom 0.305: v28.26,42.86 28.26,44.77 v31.43,47.94
PA10_USB_ID  (via drill 0.3)
  Top 0.305: X4.4 15.72,9.68 v15.56,9.84 | v15.56,15.56 25.4,15.56 29.21,19.37 v29.21,43.5 | v31.75,46.99 32.56,47.8 U$9.69
  Bottom 0.305: v15.56,9.84 v15.56,15.56 | v29.21,43.5 29.21,44.45 v31.75,46.99
PA11_USB_DM
  Top 0.305: R6.1 28.89,14.61 31.43,17.14 31.43,45.72 33.02,47.31 33.03,47.3 U$9.70
PA12_USB_DP
  Top 0.305: U$9.71 33.47,46.8 32.07,45.4 32.07,16.83 28.57,13.34 19.68,13.34 18.73,12.38 R9.1
PA15_TIM2_CH1  (via drill 0.3)
  Top 0.305: JP7.3 18.1,85.72 19.37,84.45 19.37,43.18 20.64,41.91 26.04,41.91 v26.99,40.96 | v33.97,43.5 35.88,45.4 v40.64,45.4 | v50.8,45.4 51.65,44.55 U$9.77
  Bottom 0.305: v26.99,40.96 31.43,40.96 v33.97,43.5 | v40.64,45.4 v50.8,45.4
PB0  (via drill 0.3)
  Top 0.305: U$9.35 58.65,65 59.69,66.04 62.23,66.04 65.72,69.53 70.8,69.53 77.15,75.88 107,75.88 v109.54,78.42
  Bottom 0.305: v109.54,78.42 JP6.9
PB1  (via drill 0.3)
  Top 0.305: U$9.36 58.15,65.45 59.37,66.67 61.91,66.67 65.41,70.17 70.48,70.17 76.83,76.52 105.09,76.52 v107,78.42
  Bottom 0.305: v107,78.42 JP6.7
PB2  (via drill 0.3)
  Top 0.305: U$9.37 57.65,65.91 59.05,67.31 61.59,67.31 65.09,70.8 70.17,70.8 76.52,77.15 102.87,77.15 v104.46,78.74
  Bottom 0.305: v104.46,78.74 JP6.5
PB3_TIM2_CH2  (via drill 0.3)
  Top 0.305: JP7.4 19.37,91.12 19.37,85.41 20,84.77 20,43.5 20.95,42.55 26.67,42.55 v27.3,41.91 | v33.02,44.13 33.02,45.4 33.66,46.04 v41.27,46.04 | v51.44,46.04 55.56,46.04 57.65,43.95 U$9.89
  Bottom 0.305: v27.3,41.91 30.8,41.91 v33.02,44.13 | v41.27,46.04 v51.44,46.04
PB4_SPI1_MISO  (via drill 0.3)
  Top 0.305: U$9.90 58.15,33.29 63.5,27.94 63.5,15.88 66.36,13.02 v83.82,13.02 | v97.47,8.57 99.1,8.57 U$5.2 U$6.2 U$7.2
  Bottom 0.305: v97.47,8.57 92.71,13.34 84.14,13.34 v83.82,13.02
PB5_SPI1_MOSI  (via drill 0.3)
  Top 0.305: U$9.91 58.65,33.58 63.98,28.26 63.98,16.19 66.36,13.81 v83.03,13.81 | v97.63,9.53 U$5.3 U$6.3 U$7.3
  Bottom 0.305: v83.03,13.81 93.34,13.81 v97.63,9.53
PB6_USART1_TX  (via drill 0.3)
  Top 0.305: U$9.92 59.15,44.86 60.01,45.72 v60.96,45.72 | v73.34,41.59 81.12,41.59 91.6,31.11 135.89,31.11 140.97,36.2 140.97,49.34 XB1.3
  Bottom 0.305: v60.96,45.72 61.91,45.72 65.09,42.55 72.39,42.55 v73.34,41.59
PB7_USART1_RX  (via drill 0.3)
  Top 0.305: U$9.93 59.65,44.41 60.01,44.77 v61.59,44.77 | v72.71,40.96 80.8,40.96 91.28,30.48 136.05,30.48 142.88,37.31 142.88,49.4 XB1.2
  Bottom 0.305: v61.59,44.77 64.45,41.91 71.75,41.91 v72.71,40.96
PB8_I2C1_SCL  (via drill 0.3)
  Top 0.305: v67.63,39.69 71.44,43.5 105.86,43.5 AQM0802A-RN-GBW.P$8 107.45,42.99 110.49,46.04 U$10.3 R20.1 | v60.96,39.69 60.65,40 U$9.95
  Bottom 0.305: v67.63,39.69 v60.96,39.69
PB9_I2C1_SDA  (via drill 0.3)
  Top 0.305: v69.22,40.32 71.75,42.86 105,42.86 AQM0802A-RN-GBW.P$7 108.49,41.49 110.49,43.5 U$10.4 R21.1 | v61.59,40.32 61.15,40.77 U$9.96
  Bottom 0.305: v69.22,40.32 v61.59,40.32
PB10_SPI2_SS0  (via drill 0.3)
  Top 0.305: U$9.47 52.65,70.11 v53.34,70.8 | v53.34,79.38 65.72,79.38 79.3,92.95 U$2.5
  Bottom 0.305: v53.34,70.8 v53.34,79.38
PB11_SPI2_SS1  (via drill 0.3)
  Top 0.305: U$9.48 52.15,72.47 v52.39,72.71 | v52.39,78.74 66.04,78.74 79.06,91.76 84.45,91.76 85.72,93.03 91.36,93.03 U$3.5
  Bottom 0.305: v52.39,72.71 v52.39,78.74
PB12_SPI2_SS2  (via drill 0.3)
  Top 0.305: v44.45,57.15 44.45,68.9 48.58,73.03 U$11.10 | v47.31,57.15 47.66,56.8 U$9.51
  Bottom 0.305: v44.45,57.15 v47.31,57.15
PB13_SPI2_SCK  (via drill 0.3)
  Top 0.305: U$9.52 46.89,56.3 46.35,56.83 46.35,67.94 52.39,73.98 U$11.13 52.39,76.2 52.7,76.52 67.63,76.52 v75.56,84.45 | v77.79,88.9 79.33,90.45 U$2.4 U$3.4
  Bottom 0.305: v75.56,84.45 75.56,86.68 v77.79,88.9
PB14_SPI2_MISO
  Top 0.305: U$9.53 46.44,55.8 45.72,56.52 45.72,68.26 51.12,73.66 U$11.12 51.12,76.83 51.44,77.15 66.67,77.15 74.97,85.45 U$2.2 U$3.2
PB15_SPI2_MOSI
  Top 0.305: U$9.54 45.98,55.3 45.09,56.2 45.09,68.58 49.85,73.34 U$11.11 49.85,76.52 51.12,77.79 66.36,77.79 76.52,87.95 U$2.3 U$3.3
PC6_TIM8_CH1
  Top 0.305: IC1.12 27.94,45.4 28.57,46.04 28.57,49.21 30.16,50.8 U$9.63
PC7_TIM8_CH2
  Top 0.305: IC1.11 28.57,44.13 29.21,44.77 29.21,48.9 30.61,50.3 U$9.64
PC8_SDIO_D0  (via drill 0.3)
  Top 0.305: U$9.65 31.07,49.8 29.84,48.58 v29.84,18.73
  Bottom 0.305: v29.84,18.73 29.84,16.81 U$1.7
PC9_SDIO_D1  (via drill 0.3)
  Top 0.305: U$9.66 31.84,49.3 30.8,48.26 v30.8,18.73
  Bottom 0.305: v30.8,18.73 30.8,16.77 U$1.8
PC10_SDIO_D2  (via drill 0.3)
  Top 0.305: v33.02,31.11 33.02,38.73 34.29,40.01 51.75,40.01 52.15,40.4 U$9.78
  Bottom 0.305: U$1.1 23.15,21.25 v33.02,31.11
PC11_SDIO_D3  (via drill 0.3)
  Top 0.305: v33.66,30.16 33.66,38.42 34.61,39.37 52.07,39.37 52.65,39.95 U$9.79
  Bottom 0.305: U$1.2 24.25,20.76 v33.66,30.16
PC12_SDIO_CK  (via drill 0.3)
  Top 0.305: v34.29,26.67 34.29,38.1 34.92,38.73 52.39,38.73 53.15,39.5 U$9.80
  Bottom 0.305: U$1.5 27.62,16.79 27.62,20 v34.29,26.67
PC13_LED0  (via drill 0.3)
  Top 0.305: U$9.7 62.72,47.8 v61.59,46.67 | v70.48,40.01 80.33,40.01 v86.04,34.29 | v93.34,26.04 122.24,26.04 v124.46,23.81
  Bottom 0.305: v61.59,46.67 60.33,46.67 59.69,46.04 59.69,39.37 60.64,38.42 68.9,38.42 v70.48,40.01 | v124.46,23.81 131.76,16.51 R54.2 | v86.04,34.29 90.81,29.53 91.76,29.53 93.34,27.94 v93.34,26.04
PD0_CAN1_RX
  Top 0.305: U$8.4 47.62,37.15 48.58,38.1 52.7,38.1 53.65,39.05 U$9.81
PD1_CAN1_TX
  Top 0.305: U$8.1 51.44,32.38 54.15,35.1 U$9.82
PD2_SDIO_CMD  (via drill 0.3)
  Top 0.305: U$9.83 54.65,31.16 52.07,28.57 v43.18,28.57
  Bottom 0.305: U$1.3 25.35,20.59 33.34,28.57 v43.18,28.57
PD3_SPI1_SS1  (via drill 0.3)
  Top 0.305: U$9.84 55.15,31.53 62.23,24.45 62.23,15.24 66.04,11.43 v84.45,11.43
  Bottom 0.305: U$6.5 109.86,12.94 109.86,3.17 108.9,2.22 92.71,2.22 88.9,6.03 85.72,6.03 84.45,7.3 v84.45,11.43
PD4_SPI1_SS2  (via drill 0.3)
  Top 0.305: U$9.85 55.65,31.98 62.87,24.77 62.87,15.56 66.36,12.06 v83.5,12.06 | v114.94,1.27 117.47,3.81 117.47,12.94 U$7.5
  Bottom 0.305: v83.5,12.06 83.5,3.81 86.04,1.27 v114.94,1.27
PD5_USART2_TX  (via drill 0.3)
  Top 0.305: U$9.86 56.15,32.75 v59.69,29.21 | v90.49,27.62 122.56,27.62 125.41,24.77 132.08,24.77 132.44,24.41 IC3.5
  Bottom 0.305: v59.69,29.21 63.5,29.21 66.36,32.07 86.04,32.07 v90.49,27.62
PD6_USART2_RX  (via drill 0.3)
  Top 0.305: U$9.87 56.65,33.52 v60.33,29.84 | v91.12,28.26 122.87,28.26 125.73,25.4 134.3,25.4 135.03,24.67 IC3.1
  Bottom 0.305: v60.33,29.84 63.18,29.84 66.36,33.02 86.36,33.02 v91.12,28.26
PD8_LED1  (via drill 0.3)
  Top 0.305: U$9.55 45.21,54.8 43.5,56.52 v43.5,67.31 | v64.77,67.31 96.2,67.31 98.11,65.41 98.11,59.37 100.01,57.47 108.48,57.47 R13.1
  Bottom 0.305: v43.5,67.31 v64.77,67.31
PD9_LED2  (via drill 0.3)
  Top 0.305: U$9.56 44.76,54.3 42.55,56.52 42.55,67.63 v43.18,68.26 | v66.67,68.26 66.99,67.94 96.52,67.94 98.74,65.72 98.74,61.91 98.96,61.7 R16.1
  Bottom 0.305: v43.18,68.26 v66.67,68.26
PD10_LED3  (via drill 0.3)
  Top 0.305: U$9.57 44.31,53.8 41.91,56.2 41.91,68.58 v42.55,69.22 | v72.07,68.58 96.84,68.58 99.69,65.72 108.48,65.72 R19.1
  Bottom 0.305: v42.55,69.22 71.44,69.22 v72.07,68.58
PD11_LED4  (via drill 0.3)
  Top 0.305: U$9.58 43.85,53.3 41.27,55.88 v41.27,69.85 | v72.71,69.85 108.48,69.85 R25.1
  Bottom 0.305: v41.27,69.85 v72.71,69.85
PD12_TIM4_CH1
  Top 0.305: JP7.9 24.45,88.58 24.45,60.01 31.66,52.8 U$9.59
PD13_TIM4_CH2
  Top 0.305: JP7.10 24.45,91.12 24.45,89.53 23.81,88.9 23.81,59.69 31.2,52.3 U$9.60
PD14_TIM4_CH3
  Top 0.305: JP7.7 23.18,59.37 30.75,51.8 U$9.61
PD15_TIM4_CH4
  Top 0.305: U$9.62 30.3,51.3 22.54,59.05 22.54,88.9 21.91,89.53 21.91,91.12 JP7.8
PE0_GYRO_INT  (via drill 0.3)
  Top 0.305: U$9.97 61.65,41.54 v61.91,41.27 | v71.12,41.27 72.07,42.23 v104.46,42.23
  Bottom 0.305: v61.91,41.27 v71.12,41.27 | v104.46,42.23 104.46,44.45 107.31,47.31 117.79,47.31 119.06,46.04 U$10.8
PE1_SW1
  Top 0.305: U$9.98 62.15,44.05 62.23,44.13 102.55,44.13 111.12,52.7 133.67,52.7 135.25,54.29 135.25,58.85 S5.4 S5.3
PE2_SW2
  Top 0.305: U$9.1 102.27,44.8 110.81,53.34 133.35,53.34 134.62,54.61 134.62,67.11 S6.4
  Top 0.406: S6.4 S6.3
PE3_SW3
  Top 0.305: U$9.2 101.81,45.3 110.49,53.98 133.03,53.98 133.99,54.93 133.99,75.36 S7.4
  Top 0.406: S7.4 S7.3
PE4_SW4
  Top 0.305: U$9.3 101.36,45.8 110.17,54.61 132.72,54.61 133.35,55.24 133.35,83.62 S8.4
  Top 0.406: S8.4 S8.3
PE5_TIM9_CH1  (via drill 0.3)
  Top 0.305: U$12.1 83.53,63.52 82.23,62.23 v82.23,55.24 | v82.23,53.34 82.23,46.67 81.86,46.3 U$9.4
  Bottom 0.305: v82.23,55.24 v82.23,53.34
PE7  (via drill 0.3)
  Top 0.305: U$9.38 57.15,66.36 58.74,67.94 61.28,67.94 64.77,71.44 69.85,71.44 76.2,77.79 100.97,77.79 v101.92,78.74
  Bottom 0.305: v101.92,78.74 JP6.3
PE8  (via drill 0.3)
  Top 0.305: U$9.39 56.65,66.81 58.42,68.58 60.96,68.58 64.45,72.07 69.53,72.07 76.2,78.74 v99.38,78.74
  Bottom 0.305: v99.38,78.74 JP6.1
PE9_TIM1_CH1  (via drill 0.3)
  Top 0.305: IC1.14 24.13,47.94 v28.26,52.07 | v55.88,60.96 56.15,60.69 U$9.40
  Bottom 0.305: v28.26,52.07 32.38,52.07 41.27,60.96 v55.88,60.96
PE11_TIM1_CH2  (via drill 0.3)
  Top 0.305: U$9.42 55.15,60.07 v55.4,60.33 | v28.89,51.44 24.13,46.67 IC1.13
  Bottom 0.305: v55.4,60.33 41.59,60.33 32.7,51.44 v28.89,51.44
PE12_TOGGLE1
  Top 0.305: U$9.43 54.65,65.76 58.1,69.22 60.64,69.22 64.14,72.71 69.22,72.71 76.2,79.69 117.79,79.69 118.43,79.06 118.43,75.25 121.92,71.75 121.92,59.69 S1.1
PE13_TOGGLE2
  Top 0.305: U$9.44 54.15,66.22 57.78,69.85 60.33,69.85 63.82,73.34 68.9,73.34 75.88,80.33 118.11,80.33 119.06,79.38 119.06,75.56 123.19,71.44 S2.1
PE14_TOGGLE3
  Top 0.305: U$9.45 53.65,66.67 57.47,70.48 60.01,70.48 63.5,73.98 68.58,73.98 75.56,80.96 122.24,80.96 123.19,80.01 S3.1
PE15_TOGGLE4
  Top 0.305: U$9.46 53.15,67.12 57.15,71.12 59.69,71.12 63.18,74.61 68.26,74.61 75.25,81.6 119.7,81.6 S4.1
RESET  (via drill 0.3)
  Top 0.305: AQM0802A-RN-GBW.P$9 107.95,46.08 v107.95,48.26 | v52.39,46.99 56.7,51.3 U$9.14 68.76,51.3 71.72,54.25 S9.3 S9.4 92.43,46.35 100.65,46.35 v102.55,48.26 | v47.31,37.78 46.35,36.83 46.35,30.48 45.4,29.53 42.86,29.53 39.79,26.45 R2.1
  Top 0.61: SJ5.2 39.79,17.69 R2.1
  Bottom 0.305: v107.95,48.26 v102.55,48.26 | v52.39,46.99 52.39,42.86 v47.31,37.78
S$1  (via drill 3.2 pad 6)
  other vias: 145,5
S$900  (via drill 3.2 pad 6)
  other vias: 5,5
S$901  (via drill 3.2 pad 6)
  other vias: 75,5

## Text on the board
tSilk: V3.0.1
_tsilk: 7-12V IN